# EAGLE board XmasRings (EAGLE 7.5.0), part 1 of 2
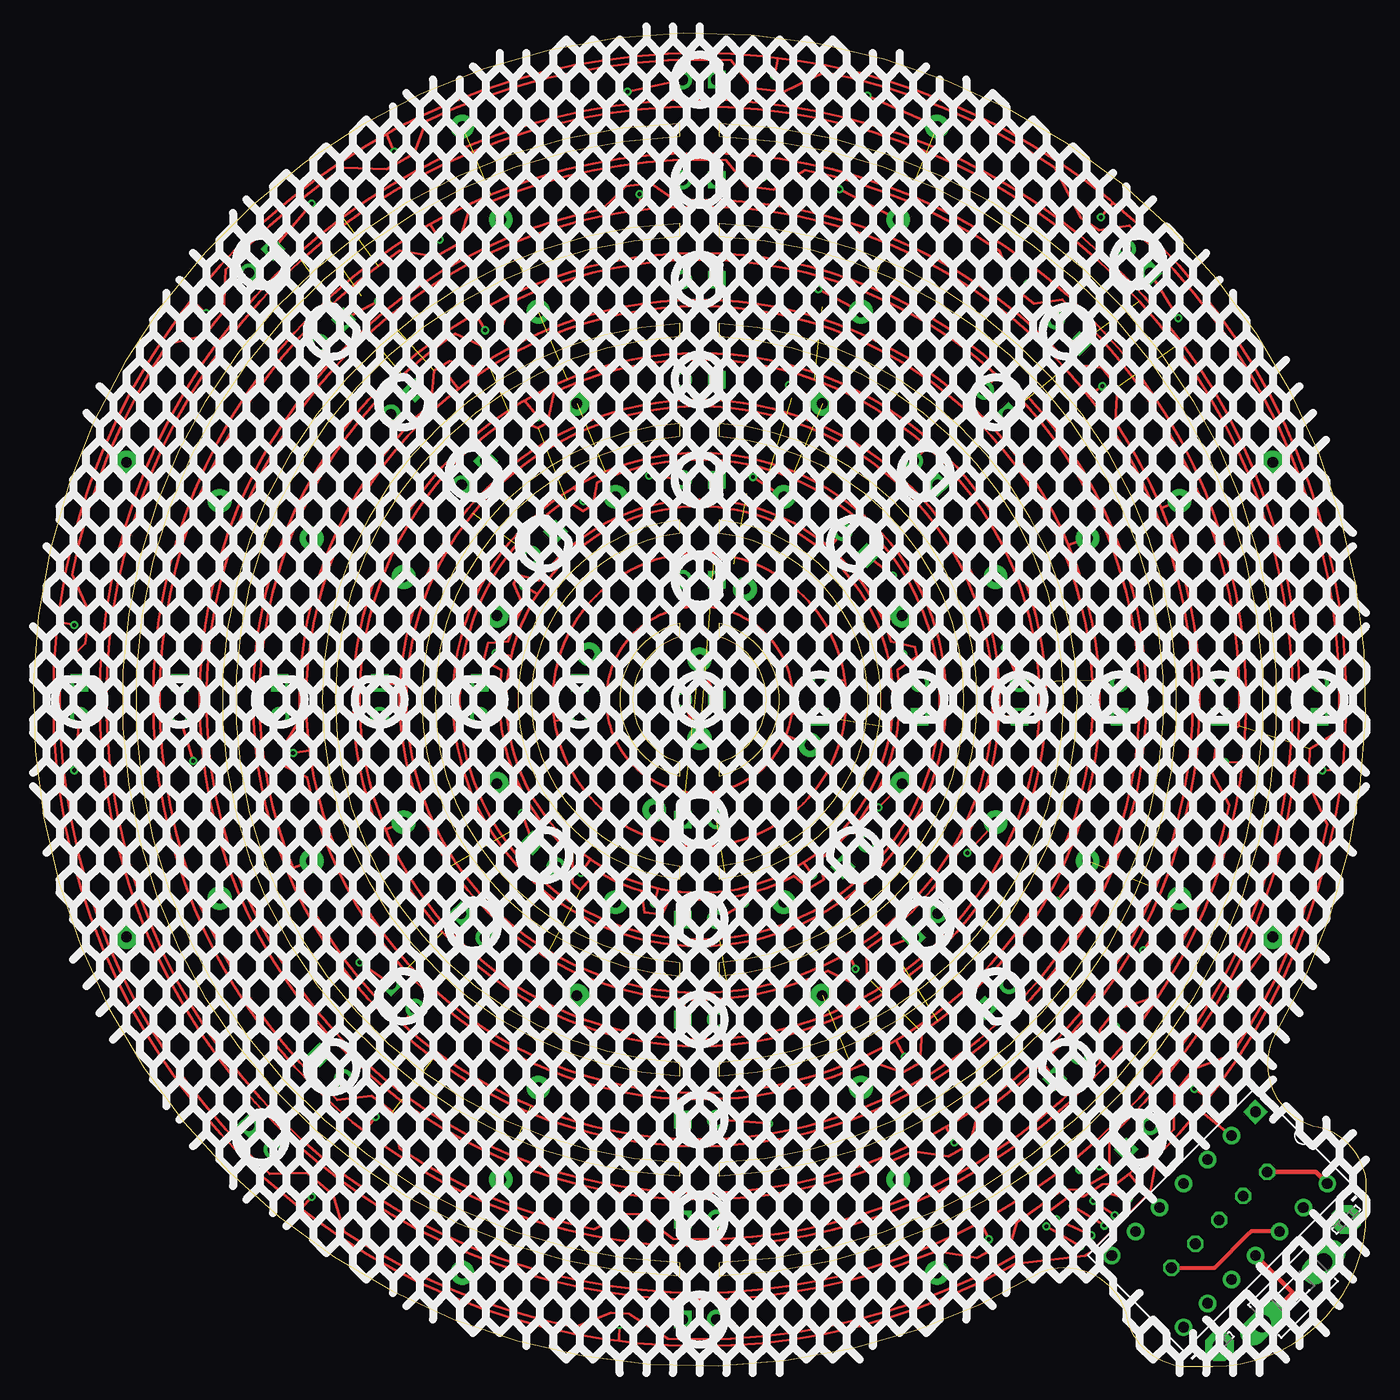
[diagram p1: board, top side]
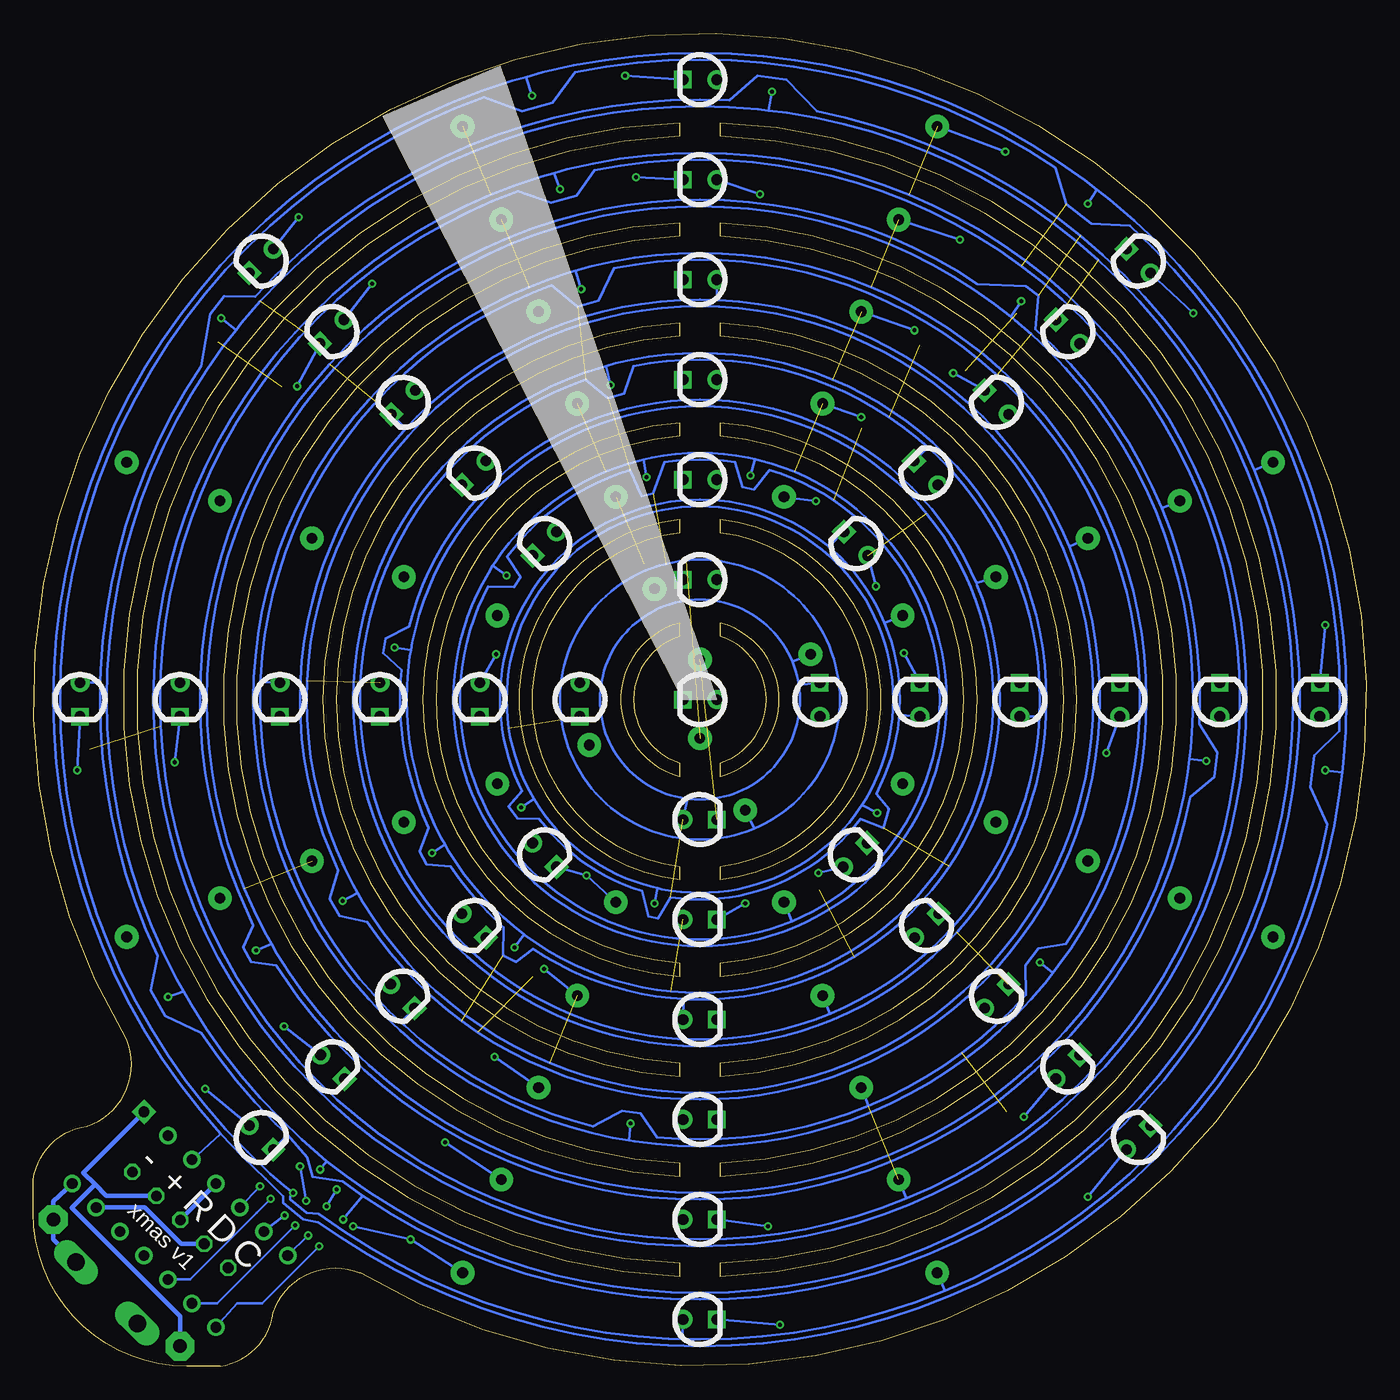
[diagram p2: board, bottom side, seen from below]

Size 99.98 x 99.98 mm. Coordinates in mm from the lower left corner, seen from the top.
Outline: 85.98,0 arc-74 81.98,4 arc94 75.48,7 arc-331 92.98,24.5 arc94 95.98,18 arc-74 99.98,14 99.98,11.5 arc-90 88.48,0 85.98,0
Outline: 48.48,36.5 arc-167 48.48,63.5 48.48,62.5 arc166 48.48,37.5 48.48,36.5
Outline: 48.48,29.25 arc-172 48.48,70.75 48.48,69.75 arc171 48.48,30.25 48.48,29.25
Outline: 48.48,44.25 arc-151 48.48,55.75 48.48,54.75 arc145 48.48,45.25 48.48,44.25
Outline: 48.48,21.75 arc-174 48.48,78.25 48.48,77.25 arc174 48.48,22.75 48.48,21.75
Outline: 48.48,15.25 arc-175 48.48,84.75 48.48,85.75 arc175 48.48,14.25 48.48,15.25
Outline: 48.48,6.75 arc-176 48.48,93.25 48.48,92.25 arc176 48.48,7.75 48.48,6.75
Outline: 51.48,63.5 arc-167 51.48,36.5 51.48,37.5 arc166 51.48,62.5 51.48,63.5
Outline: 51.48,70.75 arc-172 51.48,29.25 51.48,30.25 arc171 51.48,69.75 51.48,70.75
Outline: 51.48,55.75 arc-151 51.48,44.25 51.48,45.25 arc145 51.48,54.75 51.48,55.75
Outline: 51.48,78.25 arc-174 51.48,21.75 51.48,22.75 arc174 51.48,77.25 51.48,78.25
Outline: 51.48,84.75 arc-175 51.48,15.25 51.48,14.25 arc175 51.48,85.75 51.48,84.75
Outline: 51.48,93.25 arc-176 51.48,6.75 51.48,7.75 arc176 51.48,92.25 51.48,93.25
Copper layers (1*16): Top 0.035mm / dielectric 1.5mm / Bottom 0.035mm
Design rules "dirt_cheap_dirty_boards.v1": minimum track width 5mil, minimum drill 12mil, track to track 5mil, track to pad 5mil, pad to pad 5mil, via to via 5mil, smd to smd 0mil, copper to edge 10mil, drill to drill 10mil, minimum pad ring 10mil, minimum via ring 6mil, stop-mask expansion 2mil, vias tented up to drill 25mil, thermal gap 10mil
Net classes: 0 default: width 0.152 mm, drill 0.305 mm, clearance 0.152 mm

## Footprints (pad centres in the part's own frame; a part is rotated, then mirrored left to right if it is on the bottom)
LSP10 = drill 1.016 pad 2.159 octagon: MP 0,0
PAD08SS = drill 0.8 pad 1.778: MP 0,0
DIP14 = drill 0.8 square: 1 -7.62,-3.81 | drill 0.8: 2 -5.08,-3.81; 3 -2.54,-3.81; 4 0,-3.81; 5 2.54,-3.81; 6 5.08,-3.81; 7 7.62,-3.81; 8 7.62,3.81; 9 5.08,3.81; 10 2.54,3.81; 11 0,3.81; 12 -2.54,3.81; 13 -5.08,3.81; 14 -7.62,3.81
5MM-SQ = drill 0.8 pad 1.422: A -1.27,0 | drill 0.8 square: C 1.27,0
DTS-3 = drill 1.3 long: 1 -3.25,0; 2 3.25,0

## Placement (x,y rotation side)
+  LSP10  [LSP10]  88.98,1.5 45 top
-  LSP10  [LSP10]  98.48,11 45 top
H1A  PADH08SS  [PAD08SS]  32.18,93 0 top
H1B  PADH08SS  [PAD08SS]  35.08,86 0 top
H1C  PADH08SS  [PAD08SS]  37.88,79.1 0 top
H1D  PADH08SS  [PAD08SS]  40.78,72.2 0 top
H1E  PADH08SS  [PAD08SS]  43.68,65.2 0 top
H2A  PADH08SS  [PAD08SS]  6.98,32.2 0 top
H2B  PADH08SS  [PAD08SS]  13.98,35.1 0 top
H2C  PADH08SS  [PAD08SS]  20.88,37.9 0 top
H2D  PADH08SS  [PAD08SS]  27.78,40.8 0 top
H2E  PADH08SS  [PAD08SS]  34.78,43.7 0 top
H3A  PADH08SS  [PAD08SS]  92.98,67.8 0 top
H3B  PADH08SS  [PAD08SS]  85.98,64.9 0 top
H3C  PADH08SS  [PAD08SS]  79.08,62.1 0 top
H3D  PADH08SS  [PAD08SS]  72.18,59.2 0 top
H3E  PADH08SS  [PAD08SS]  65.18,56.3 0 top
H4A  PADH08SS  [PAD08SS]  67.78,7 0 top
H4B  PADH08SS  [PAD08SS]  64.88,14 0 top
H4C  PADH08SS  [PAD08SS]  62.08,20.9 0 top
H4D  PADH08SS  [PAD08SS]  59.18,27.8 0 top
H4E  PADH08SS  [PAD08SS]  56.28,34.8 0 top
H5A  PADH08SS  [PAD08SS]  67.78,93 0 top
H5B  PADH08SS  [PAD08SS]  64.88,86 0 top
H5C  PADH08SS  [PAD08SS]  62.08,79.1 0 top
H5D  PADH08SS  [PAD08SS]  59.18,72.2 0 top
H5E  PADH08SS  [PAD08SS]  56.28,65.2 0 top
H5F  PADH08SS  [PAD08SS]  53.38,58.3 0 top
H5G  PADH08SS  [PAD08SS]  49.98,53 0 top
H6A  PADH08SS  [PAD08SS]  32.18,7 90 top
H6B  PADH08SS  [PAD08SS]  35.08,14 90 top
H6C  PADH08SS  [PAD08SS]  37.88,20.9 90 top
H6D  PADH08SS  [PAD08SS]  40.78,27.8 90 top
H6E  PADH08SS  [PAD08SS]  43.68,34.8 90 top
H6F  PADH08SS  [PAD08SS]  46.58,41.7 90 top
H6G  PADH08SS  [PAD08SS]  49.98,47.1 0 top
H7A  PADH08SS  [PAD08SS]  6.98,67.8 0 top
H7B  PADH08SS  [PAD08SS]  13.98,64.9 0 top
H7C  PADH08SS  [PAD08SS]  20.88,62.1 0 top
H7D  PADH08SS  [PAD08SS]  27.78,59.2 0 top
H7E  PADH08SS  [PAD08SS]  34.78,56.3 0 top
H7F  PADH08SS  [PAD08SS]  41.68,53.4 0 top
H8A  PADH08SS  [PAD08SS]  92.98,32.2 0 top
H8B  PADH08SS  [PAD08SS]  85.98,35.1 0 top
H8C  PADH08SS  [PAD08SS]  79.08,37.9 0 top
H8D  PADH08SS  [PAD08SS]  72.18,40.8 0 top
H8E  PADH08SS  [PAD08SS]  65.18,43.7 0 top
H8F  PADH08SS  [PAD08SS]  58.28,46.6 0 top
IC2  IC_UC_PIC16F1823-DIL14  [DIP14]  88.98,11 225 top
LED1  LED5SQ  [5MM-SQ]  49.98,96.5 0 top
LED2  LED5SQ  [5MM-SQ]  82.88,82.9 315 top
LED3  LED5SQ  [5MM-SQ]  96.48,50 270 top
LED4  LED5SQ  [5MM-SQ]  82.88,17.15 225 top
LED5  LED5SQ  [5MM-SQ]  49.98,3.5 180 top
LED6  LED5SQ  [5MM-SQ]  17.08,17.15 135 top
LED7  LED5SQ  [5MM-SQ]  3.48,50 90 top
LED8  LED5SQ  [5MM-SQ]  17.08,82.9 45 top
LED9  LED5SQ  [5MM-SQ]  49.98,89 0 top
LED10  LED5SQ  [5MM-SQ]  77.58,77.6 315 top
LED11  LED5SQ  [5MM-SQ]  88.98,50 270 top
LED12  LED5SQ  [5MM-SQ]  77.53,22.45 225 top
LED13  LED5SQ  [5MM-SQ]  49.98,11 180 top
LED14  LED5SQ  [5MM-SQ]  22.38,22.45 135 top
LED15  LED5SQ  [5MM-SQ]  10.98,50 90 top
LED16  LED5SQ  [5MM-SQ]  22.38,77.6 45 top
LED17  LED5SQ  [5MM-SQ]  49.98,81.5 0 top
LED18  LED5SQ  [5MM-SQ]  72.23,72.3 315 top
LED19  LED5SQ  [5MM-SQ]  81.48,50 270 top
LED20  LED5SQ  [5MM-SQ]  72.28,27.75 225 top
LED21  LED5SQ  [5MM-SQ]  49.98,18.5 180 top
LED22  LED5SQ  [5MM-SQ]  27.73,27.75 135 top
LED23  LED5SQ  [5MM-SQ]  18.48,50 90 top
LED24  LED5SQ  [5MM-SQ]  27.73,72.3 45 top
LED25  LED5SQ  [5MM-SQ]  49.98,74 0 top
LED26  LED5SQ  [5MM-SQ]  66.93,67 315 top
LED27  LED5SQ  [5MM-SQ]  73.98,50 270 top
LED28  LED5SQ  [5MM-SQ]  66.93,33.05 225 top
LED29  LED5SQ  [5MM-SQ]  49.98,26 180 top
LED30  LED5SQ  [5MM-SQ]  32.98,33.05 135 top
LED31  LED5SQ  [5MM-SQ]  25.98,50 90 top
LED32  LED5SQ  [5MM-SQ]  33.03,67 45 top
LED33  LED5SQ  [5MM-SQ]  49.98,66.5 0 top
LED34  LED5SQ  [5MM-SQ]  61.63,61.7 315 top
LED35  LED5SQ  [5MM-SQ]  66.48,50 270 top
LED36  LED5SQ  [5MM-SQ]  61.63,38.35 225 top
LED37  LED5SQ  [5MM-SQ]  49.98,33.5 180 top
LED38  LED5SQ  [5MM-SQ]  38.33,38.35 135 top
LED39  LED5SQ  [5MM-SQ]  33.48,50 90 top
LED40  LED5SQ  [5MM-SQ]  38.28,61.7 45 top
LED41  LED5SQ  [5MM-SQ]  49.98,59 0 top
LED42  LED5SQ  [5MM-SQ]  58.98,50 270 top
LED43  LED5SQ  [5MM-SQ]  49.98,41 180 top
LED44  LED5SQ  [5MM-SQ]  40.98,50 90 top
LED45  LED5SQ  [5MM-SQ]  49.98,50 0 top
S1  DTS-3  [DTS-3]  94.48,5.5 45 top

## Tracks (layer width: path | path; a pad name or v marks a point on that pad's centre or on a via)
/RES  (via drill 0.8)
  Bottom 0.356: v88.95,10.97 IC2.4
CLK  (via drill 0.8)
  Top 0.203: 91.33,10.1 91.23,10
  Top 0.305: v85.36,7.38 88.61,7.38 91.23,10 | IC2.12 91.33,10.1
CP1  (via drill 0.3)  (4 unrouted)
  Top 0.203: 55.85,98.13 54.73,98.27 52.36,98.44 49.98,98.5 47.6,98.44 45.22,98.27 42.86,97.97 40.52,97.57 38.19,97.05 35.9,96.41 33.64,95.67 31.42,94.81 29.24,93.84 27.11,92.77 26.48,92.42 | 55.85,98.13 57.09,97.97 59.44,97.57 61.76,97.05 64.06,96.41 66.32,95.67 68.54,94.81 70.71,93.84 72.84,92.77 74.91,91.6 76.92,90.33 78.87,88.96 80.75,87.49 80.99,87.28 | 80.99,87.28 82.55,85.94 84.27,84.3 85.91,82.57 87.47,80.77 88.93,78.89 90.3,76.94 91.58,74.93 92.75,72.86 93.82,70.74 94.79,68.56 95.64,66.34 96.39,64.08 97.02,61.78 97.55,59.46 97.95,57.12 98.24,54.75 98.42,52.38 98.48,50 98.42,47.62 98.24,45.25 98.18,44.74 | 98.18,44.74 97.95,42.88 97.55,40.54 97.02,38.22 96.39,35.92 95.64,33.66 94.79,31.44 93.82,29.26 92.75,27.14 91.58,25.07 90.3,23.05 88.93,21.11 88.15,20.11 | 88.15,20.11 87.47,19.23 | 87.47,19.23 85.91,17.43 84.27,15.71 83.8,13.06 79.25,8.51 78.87,8.29 73.67,7.67 73.16,7.4 72.84,7.23 70.71,6.16 68.54,5.19 66.32,4.33 64.06,3.59 61.76,2.95 59.44,2.43 57.09,2.02 54.73,1.73 52.36,1.56 49.98,1.5 47.6,1.56 45.22,1.73 43.93,1.89 | 43.93,1.89 42.86,2.02 40.52,2.43 38.19,2.95 35.9,3.59 33.64,4.33 31.42,5.19 29.24,6.16 27.11,7.23 25.04,8.4 23.03,9.67 21.09,11.04 20.11,11.81 | 20.11,11.81 19.21,12.51 17.41,14.06 15.68,15.71 14.04,17.43 12.49,19.23 11.02,21.11 9.65,23.05 8.38,25.07 7.2,27.14 6.13,29.26 5.17,31.44 4.31,33.66 3.57,35.92 2.93,38.22 2.41,40.54 2,42.88 1.71,45.25 1.54,47.62 1.48,50 1.54,52.38 1.71,54.75 1.85,55.87 | 1.85,55.87 2,57.12 2.41,59.46 2.93,61.78 3.57,64.08 4.31,66.34 5.17,68.56 6.13,70.74 7.2,72.86 8.38,74.93 9.65,76.94 11.02,78.89 11.89,80
  Top 0.203: 11.89,80 12.49,80.77 14.04,82.57 15.68,84.3 17.41,85.94 19.21,87.49 21.09,88.96 23.03,90.33 25.04,91.6 26.48,92.42 | 55.05,90.67 54,90.8 51.99,90.95 49.98,91 47.97,90.95 45.96,90.8 43.96,90.56 41.98,90.21 40.02,89.77 38.08,89.23 36.17,88.6 34.29,87.88 32.45,87.06 30.65,86.16 29.76,85.66 | 55.05,90.67 55.99,90.56 57.98,90.21 59.94,89.77 61.88,89.23 63.79,88.6 65.67,87.88 67.51,87.06 69.3,86.16 71.06,85.17 72.76,84.09 74.4,82.93 75.31,82.22 | 75.31,82.22 75.99,81.69 77.51,80.38 78.97,78.99 80.36,77.53 81.67,76.01 82.91,74.42 84.07,72.78 85.14,71.08 86.14,69.33 87.04,67.53 87.86,65.69 88.58,63.81 89.21,61.9 89.75,59.96 90.19,58 90.53,56.02 90.78,54.02 90.93,52.01 90.98,50 90.93,47.99 90.78,45.98 90.7,45.32 | 90.7,45.32 90.53,43.98 90.19,42 89.75,40.04 89.21,38.1 88.58,36.19 87.86,34.31 87.04,32.47 86.14,30.67 85.14,28.92 84.07,27.22 82.91,25.58 82.29,24.78 | 82.29,24.78 81.67,23.99 80.36,22.47 78.97,21.01 77.51,19.62 75.99,18.31 74.4,17.07 72.76,15.91 71.06,14.83 69.3,13.84 67.51,12.94 65.67,12.12 63.79,11.4 61.88,10.77 59.94,10.23 57.98,9.79 55.99,9.44 54,9.2 51.99,9.05 49.98,9 47.97,9.05 45.96,9.2 44.71,9.35 | 44.71,9.35 43.96,9.44 41.98,9.79 40.02,10.23 38.08,10.77 36.17,11.4 34.29,12.12 32.45,12.94 30.65,13.84 28.9,14.83 27.2,15.91 25.55,17.07 24.87,17.6 | 24.87,17.6 23.97,18.31 22.44,19.62 20.99,21.01 19.6,22.47 18.28,23.99 17.05,25.58 15.89,27.22 14.81,28.92 13.82,30.67 12.91,32.47 12.1,34.31 11.37,36.19 10.74,38.1 10.21,40.04 9.77,42 9.42,43.98 9.17,45.98 9.03,47.99 8.98,50 9.03,52.01 9.17,54.02 9.42,56.02 9.77,58 10.21,59.96 10.74,61.9 11.37,63.81 12.1,65.69 12.91,67.53 13.82,69.33 14.81,71.08 15.89,72.78 17.05,74.42 18.28,76.01 19.6,77.53 20.99,78.99 22.44,80.38 23.97,81.69 25.55,82.93 27.2,84.09 28.9,85.17 29.76,85.66
  Top 0.203: 33.16,78.96 32.76,78.73 31.37,77.85 30.02,76.91 28.73,75.9 27.48,74.82 26.29,73.69 25.16,72.5 24.08,71.25 23.07,69.96 22.12,68.61 21.24,67.22 20.43,65.79 19.69,64.32 19.03,62.82 18.44,61.29 17.92,59.73 17.48,58.14 17.12,56.54 16.84,54.91 16.64,53.28 16.52,51.64 16.48,50 16.52,48.36 16.64,46.72 16.84,45.09 17.12,43.46 17.48,41.86 17.92,40.27 18.44,38.71 19.03,37.18 19.69,35.68 20.43,34.21 21.24,32.78 22.12,31.39 23.07,30.04 24.08,28.75 25.16,27.5 26.29,26.31 27.48,25.18 28.73,24.1 30.02,23.09 31.37,22.15 32.76,21.27 34.19,20.46 35.65,19.72 37.16,19.05 38.69,18.46 40.25,17.94 41.84,17.5 43.44,17.14 45.06,16.86 46.69,16.66 48.33,16.54 49.98,16.5 51.62,16.54 53.26,16.66 54.89,16.86 56.51,17.14 58.12,17.5 59.7,17.94 61.26,18.46 62.8,19.05 64.3,19.72 65.77,20.46 67.2,21.27 68.59,22.15 69.93,23.09 71.23,24.1 72.47,25.18 73.67,26.31 74.8,27.5 75.87,28.75 76.88,30.04 77.83,31.39 78.71,32.78 79.52,34.21 80.26,35.68 80.93,37.18 81.52,38.71 82.04,40.27 82.47,41.86 82.83,43.46 83.11,45.09 83.32,46.72 83.44,48.36 83.48,50 83.44,51.64 83.32,53.28 83.11,54.91 82.83,56.54 82.47,58.14 82.04,59.73 81.52,61.29 80.93,62.82 80.26,64.32 79.52,65.79 78.71,67.22 77.83,68.61 76.88,69.96 75.87,71.25 74.8,72.5 73.67,73.69 72.47,74.82 71.23,75.9 69.93,76.91 68.59,77.85 67.2,78.73 65.77,79.54 64.3,80.28 62.8,80.95 61.26,81.54 59.7,82.06 58.12,82.5 56.51,82.86 54.89,83.14 53.26,83.34 51.62,83.46 49.98,83.5 48.33,83.46 46.69,83.34 45.06,83.14 43.44,82.86 41.84,82.5 40.25,82.06 38.69,81.54 37.16,80.95 35.65,80.28 34.19,79.54 33.16,78.96
  Top 0.203: 36.84,72.43 36.61,72.3 35.53,71.62 34.49,70.88 33.48,70.1 32.52,69.27 31.59,68.39 30.71,67.46 29.88,66.49 29.09,65.49 28.36,64.44 27.68,63.37 27.05,62.26 26.47,61.12 25.96,59.95 25.5,58.76 25.1,57.55 24.76,56.32 24.48,55.07 24.26,53.81 24.1,52.55 24.01,51.28 23.98,50 24.01,48.72 24.1,47.45 24.26,46.19 24.48,44.93 24.76,43.68 25.1,42.45 25.5,41.24 25.96,40.05 26.47,38.88 27.05,37.74 27.68,36.63 28.36,35.55 29.09,34.51 29.88,33.51 30.71,32.54 31.59,31.61 32.52,30.73 33.48,29.9 34.49,29.12 35.53,28.38 36.61,27.7 37.72,27.07 38.86,26.5 40.03,25.98 41.22,25.52 42.43,25.12 43.66,24.78 44.91,24.5 46.16,24.28 47.43,24.12 48.7,24.03 49.98,24 51.25,24.03 52.53,24.12 53.79,24.28 55.05,24.5 56.29,24.78 57.52,25.12 58.74,25.52 59.93,25.98 61.09,26.5 62.23,27.07 63.34,27.7 64.42,28.38 65.47,29.12 66.47,29.9 67.44,30.73 68.36,31.61 69.24,32.54 70.08,33.51 70.86,34.51 71.6,35.55 72.28,36.63 72.91,37.74 73.48,38.88 74,40.05 74.46,41.24 74.86,42.45 75.2,43.68 75.48,44.93 75.7,46.19 75.85,47.45 75.95,48.72 75.98,50 75.95,51.28 75.85,52.55 75.7,53.81 75.48,55.07 75.2,56.32 74.86,57.55 74.46,58.76 74,59.95 73.48,61.12 72.91,62.26 72.28,63.37 71.6,64.44 70.86,65.49 70.08,66.49 69.24,67.46 68.36,68.39 67.44,69.27 66.47,70.1 65.47,70.88 64.42,71.62 63.34,72.3 62.23,72.93 61.09,73.5 59.93,74.02 58.74,74.48 57.52,74.88 56.29,75.22 55.05,75.5 53.79,75.72 52.53,75.88 51.25,75.97 49.98,76 48.7,75.97 47.43,75.88 46.16,75.72 44.91,75.5 43.66,75.22 42.43,74.88 41.22,74.48 40.03,74.02 38.86,73.5 37.72,72.93 36.84,72.43
  Top 0.203: 40.58,65.93 40.47,65.87 39.7,65.38 38.96,64.86 38.24,64.3 37.55,63.71 36.9,63.08 36.27,62.42 35.68,61.74 35.12,61.02 34.6,60.28 34.11,59.51 33.66,58.72 33.25,57.91 32.89,57.08 32.56,56.23 32.27,55.37 32.03,54.49 31.83,53.61 31.68,52.72 31.57,51.81 31.5,50.91 31.48,50 31.5,49.09 31.57,48.19 31.68,47.28 31.83,46.39 32.03,45.51 32.27,44.63 32.56,43.77 32.89,42.92 33.25,42.09 33.66,41.28 34.11,40.49 34.6,39.72 35.12,38.98 35.68,38.26 36.27,37.58 36.9,36.92 37.55,36.29 38.24,35.7 38.96,35.14 39.7,34.62 40.47,34.13 41.26,33.68 42.07,33.28 42.9,32.91 43.75,32.58 44.61,32.3 45.48,32.05 46.37,31.86 47.26,31.7 48.16,31.59 49.07,31.52 49.98,31.5 50.89,31.52 51.79,31.59 52.69,31.7 53.59,31.86 54.47,32.05 55.35,32.3 56.21,32.58 57.06,32.91 57.89,33.28 58.7,33.68 59.49,34.13 60.26,34.62 61,35.14 61.71,35.7 62.4,36.29 63.06,36.92 63.69,37.58 64.28,38.26 64.84,38.98 65.36,39.72 65.85,40.49 66.29,41.28 66.7,42.09 67.07,42.92 67.4,43.77 67.68,44.63 67.92,45.51 68.12,46.39 68.28,47.28 68.39,48.19 68.46,49.09 68.48,50 68.46,50.91 68.39,51.81 68.28,52.72 68.12,53.61 67.92,54.49 67.68,55.37 67.4,56.23 67.07,57.08 66.7,57.91 66.29,58.72 65.85,59.51 65.36,60.28 64.84,61.02 64.28,61.74 63.69,62.42 63.06,63.08 62.4,63.71 61.71,64.3 61,64.86 60.26,65.38 59.49,65.87 58.7,66.32 57.89,66.72 57.06,67.09 56.21,67.42 55.35,67.7 54.47,67.95 53.59,68.14 52.69,68.3 51.79,68.41 50.89,68.48 49.98,68.5 49.07,68.48 48.16,68.41 47.26,68.3 46.37,68.14 45.48,67.95 44.61,67.7 43.75,67.42 42.9,67.09 42.07,66.72 41.26,66.32 40.58,65.93
  Top 0.203: v3.08,55.6 1.85,55.87 | v12.98,79 11.89,80 | v30.48,84.5 29.76,85.66 | v33.88,77.7 33.16,78.96 | v37.88,71.2 36.84,72.43 | v41.28,64.9 40.58,65.93 | v54.78,89.2 55.05,90.67 | v55.58,96.8 55.85,98.13 | v87.08,20.8 88.15,20.11 | v81.18,25.5 82.29,24.78 | v44.88,10.5 44.71,9.35 | v43.98,3.1 43.93,1.89 | v25.68,18.7 24.87,17.6 | v20.88,12.7 20.11,11.81 | v80.08,86.2 80.99,87.28 | v74.58,81.2 75.31,82.22 | v89.38,45.3 90.7,45.32 | v96.68,44.7 98.18,44.74 | v27.08,91.1 26.48,92.42 | IC2.2 87.47,19.23
  Bottom 0.203: LED7.C v3.08,55.6 | LED8.A v12.98,79 | H1E.MP v41.28,64.9 | H1D.MP v37.88,71.2 | H1C.MP v33.88,77.7 | H1B.MP v30.48,84.5 | H1A.MP v27.08,91.1 | LED1.C v55.58,96.8 | LED9.C v54.78,89.2 | LED12.A v81.18,25.5 | LED4.A v87.08,20.8 | LED13.C v44.88,10.5 | LED5.C v43.98,3.1 | LED6.A v20.88,12.7 | LED14.A v25.68,18.7 | LED10.A v74.58,81.2 | LED2.A v80.08,86.2 | LED11.C v89.38,45.3 | LED3.C v96.68,44.7
CP2  (via drill 0.3)  (4 unrouted)
  Top 0.203: 82.21,14.43 83.92,16.06 85.54,17.77 85.58,20.45 87.03,22.31 89.89,23.33 91.15,25.32 92.31,27.37 93.37,29.48 94.32,31.63 95.17,33.83 95.91,36.07 96.54,38.34 97.06,40.64 95.66,43.66 95.75,46.3 97.92,47.65 97.98,50 97.92,52.35 97.75,54.7 97.46,57.04 97.06,59.36 96.54,61.66 95.91,63.93 95.17,66.17 94.32,68.37 93.37,70.52 92.31,72.63 91.15,74.68 89.89,76.67 88.53,78.59 87.08,80.45 85.54,82.23 83.92,83.94 82.21,85.57 79.93,85.2 78.57,86.15 76.64,89.91 74.65,91.17 72.6,92.33 70.5,93.39 68.35,94.35 66.15,95.19 63.91,95.93 61.64,96.56 59.34,97.08 56.32,95.58 53.98,95.87 52.33,97.94 49.98,98 47.62,97.94 45.27,97.77 42.93,97.48 40.61,97.08 38.31,96.56 36.04,95.93 33.81,95.19 31.61,94.35 29.45,93.39 28.55,90.93 26.5,89.77 23.31,89.91 21.38,88.55 19.53,87.11 17.74,85.57 16.04,83.94 14.41,82.23 14.27,79.15 12.82,77.29 10.07,76.67 8.81,74.68 7.65,72.63 6.59,70.52 5.63,68.37 4.78,66.17 4.04,63.93 3.42,61.66 2.9,59.36 4.2,56.54 3.91,54.2 2.04,52.35 1.98,50 2.04,47.65 2.21,45.3 2.5,42.96 2.9,40.64 3.42,38.34 4.04,36.07 4.78,33.83 5.63,31.63 | 82.21,14.43 81.23,13.68 80.18,13.64 78.78,12.75 77.73,12.75 75.22,10.9 74.79,9.29 74.65,8.83 72.6,7.67 70.5,6.61 68.35,5.65 66.15,4.81 63.91,4.07 61.64,3.44 59.34,2.92 57.02,2.52 54.68,2.23 52.33,2.06 49.98,2 47.62,2.06 44.67,3.93 43.33,4.02 40.61,2.92 38.31,3.44 36.04,4.07 33.81,4.81 31.61,5.65 29.45,6.61 27.35,7.67 25.3,8.83 23.31,10.09 22.48,12.85 20.53,14.49 17.74,14.43 16.04,16.06 14.41,17.77 12.87,19.55 11.42,21.41 10.07,23.33 8.81,25.32 7.65,27.37 6.59,29.48 5.63,31.63
  Top 0.203: 51.29,9.53 51.49,9.54 51.96,9.55 53.95,9.7 55.92,9.94 57.88,10.28 59.82,10.71 61.73,11.24 63.62,11.87 65.48,12.58 67.29,13.39 69.07,14.28 70.8,15.26 72.48,16.32 74.1,17.47 75.67,18.69 77.18,19.99 78.62,21.36 79.99,22.8 79.98,25.21 81.21,26.77 83.65,27.5 84.72,29.18 85.7,30.91 86.59,32.68 87.39,34.5 88.11,36.36 88.73,38.24 89.26,40.16 89.7,42.1 88.44,44.46 88.68,46.43 90.43,48.01 90.48,50 90.43,51.99 90.28,53.97 90.04,55.94 89.7,57.9 89.26,59.84 88.73,61.76 88.11,63.64 87.39,65.5 86.59,67.32 85.7,69.09 84.72,70.82 83.65,72.5 82.51,74.13 81.28,75.69 79.99,77.2 78.62,78.64 77.18,80.01 75.07,79.71 73.5,80.93 72.48,83.67 70.8,84.74 69.07,85.72 67.29,86.61 65.48,87.42 63.62,88.13 61.73,88.76 59.82,89.29 57.88,89.72 55.52,88.26 53.55,88.5 51.96,90.45 49.98,90.5 47.99,90.45 46.01,90.31 44.03,90.06 42.08,89.72 40.14,89.29 38.22,88.76 36.33,88.13 34.48,87.42 32.66,86.61 31.89,84.22 30.16,83.24 27.48,83.67 25.85,82.53 24.28,81.31 22.78,80.01 21.34,78.64 20.4,77.66 | 51.29,9.53 49.98,9.5 47.99,9.55 45.51,11.39 44.33,11.44 42.08,10.28 40.14,10.71 38.22,11.24 36.33,11.87 34.48,12.58 32.66,13.39 30.89,14.28 29.16,15.26 27.48,16.32 26.95,19.07 25.38,20.29 22.78,19.99 21.34,21.36 20.4,22.34 | 20.4,22.34 19.97,22.8 18.67,24.31 17.45,25.87 16.3,27.5 15.24,29.18 14.26,30.91 13.37,32.68 12.56,34.5 | 12.56,34.5 11.84,36.36 11.22,38.24 10.69,40.16 10.26,42.1 9.92,44.06 9.67,46.03 9.53,48.01 9.48,50 9.51,51.31 | 9.51,51.31 9.53,51.99 9.67,53.97 9.92,55.94 10.26,57.9 10.69,59.84 11.22,61.76 11.84,63.64 12.56,65.5 13.37,67.32 14.26,69.09 15.24,70.82 16.3,72.5 17.45,74.13 18.67,75.69 19.97,77.2 20.4,77.66
  Top 0.203: 51.29,82.97 49.98,83 48.36,82.96 46.74,82.84 45.14,82.64 43.54,82.37 41.96,82.01 40.4,81.58 38.86,81.07 37.35,80.49 35.87,79.83 34.92,77.4 33.51,76.61 31.64,77.44 30.32,76.51 29.04,75.51 27.82,74.45 26.64,73.33 25.75,72.4 | 51.29,82.97 51.6,82.96 53.21,82.84 54.82,82.64 56.42,82.37 58,82.01 59.56,81.58 61.09,81.07 62.61,80.49 64.09,79.83 65.53,79.1 66.94,78.31 68.31,77.44 69.64,76.51 70.91,75.51 72.14,74.45 72.33,74.27 | 72.33,74.27 73.31,73.33 74.43,72.16 75.49,70.94 76.48,69.66 77.42,68.33 78.28,66.97 79.08,65.56 79.81,64.11 80.47,62.63 81.05,61.12 81.56,59.58 81.99,58.02 82.34,56.44 82.62,54.84 82.82,53.23 82.94,51.62 82.98,50 82.95,48.69 | 82.95,48.69 82.94,48.38 82.82,46.77 82.62,45.16 82.34,43.56 81.99,41.98 81.56,40.42 81.05,38.88 80.47,37.37 79.81,35.89 79.08,34.44 78.28,33.03 77.42,31.67 76.48,30.34 75.49,29.07 74.43,27.84 74.25,27.65 | 74.25,27.65 73.31,26.66 72.14,25.55 70.91,24.49 69.64,23.49 68.31,22.56 66.94,21.7 65.53,20.9 64.09,20.17 62.61,19.51 61.09,18.93 59.56,18.42 58,17.99 56.42,17.63 54.82,17.36 53.21,17.16 51.6,17.04 49.98,17 48.66,17.03 | 48.66,17.03 48.36,17.04 46.74,17.16 45.14,17.36 43.54,17.63 41.96,17.99 40.4,18.42 38.86,18.93 37.35,19.51 35.87,20.17 34.42,20.9 33.01,21.7 31.64,22.56 30.32,23.49 29.04,24.49 27.82,25.55 27.68,25.68 | 27.68,25.68 26.64,26.66 25.53,27.84 24.47,29.07 23.47,30.34 22.54,31.67 21.67,33.03 20.87,34.44 20.15,35.89 19.49,37.37 | 19.49,37.37 18.91,38.88 18.4,40.42 17.97,41.98 17.61,43.56 17.33,45.16 17.14,46.77 17.02,48.38 16.98,50 17.01,51.31 | 17.01,51.31 17.02,51.62 17.14,53.23 17.33,54.84 17.61,56.44 17.97,58.02 18.4,59.58 18.91,61.12 19.49,62.63 20.15,64.11 20.87,65.56 21.67,66.97 22.54,68.33 23.47,69.66 24.47,70.94 25.53,72.16 25.75,72.4
  Top 0.203: 51.23,75.47 49.98,75.5 48.73,75.47 47.48,75.38 46.24,75.22 45,75.01 43.78,74.74 42.58,74.4 41.39,74.01 40.22,73.56 39.07,73.05 38.56,70.79 37.87,70.37 35.81,71.2 34.79,70.48 33.8,69.71 32.85,68.89 31.95,68.03 31.08,67.12 30.27,66.18 29.5,65.19 28.78,64.17 28.11,63.11 27.49,62.02 26.93,60.9 26.42,59.76 25.97,58.59 25.58,57.4 25.24,56.2 24.97,54.98 24.75,53.74 24.6,52.5 24.51,51.25 24.48,50 24.51,48.75 24.6,47.5 24.75,46.26 24.97,45.02 25.24,43.8 25.58,42.6 25.97,41.41 26.42,40.24 | 51.23,75.47 52.48,75.38 53.72,75.22 54.95,75.01 56.17,74.74 57.38,74.4 58.57,74.01 59.74,73.56 60.88,73.05 62,72.49 63.09,71.87 64.14,71.2 65.17,70.48 66.15,69.71 67.1,68.89 | 67.1,68.89 68.01,68.03 68.87,67.12 69.69,66.18 70.46,65.19 71.18,64.17 71.85,63.11 72.47,62.02 73.03,60.9 73.54,59.76 73.99,58.59 74.38,57.4 74.71,56.2 74.99,54.98 75.2,53.74 75.35,52.5 75.45,51.25 75.48,50 75.45,48.75 75.35,47.5 75.2,46.26 74.99,45.02 74.71,43.8 74.38,42.6 73.99,41.41 73.54,40.24 73.03,39.1 72.47,37.98 71.85,36.89 71.18,35.83 70.46,34.81 69.69,33.82 68.87,32.88 68.01,31.97 67.1,31.11 66.15,30.29 65.17,29.52 64.14,28.8 63.09,28.13 62,27.51 60.88,26.95 59.74,26.44 58.57,25.99 57.38,25.6 56.17,25.26 54.95,24.99 53.72,24.78 52.48,24.62 51.23,24.53 49.98,24.5 48.73,24.53 47.48,24.62 46.24,24.78 45,24.99 43.78,25.26 42.58,25.6 41.39,25.99 40.22,26.44 39.07,26.95 37.96,27.51 36.87,28.13 35.81,28.8 34.79,29.52 33.8,30.29 32.85,31.11 31.95,31.97 31.08,32.88 30.27,33.82 29.5,34.81 28.78,35.83 28.11,36.89 27.49,37.98 26.93,39.1 26.42,40.24
  Top 0.203: 33.35,43.11 33.71,42.3 34.1,41.52 34.54,40.75 35.01,40 35.52,39.28 36.06,38.58 36.64,37.91 37.25,37.27 37.89,36.66 38.56,36.09 39.25,35.54 39.98,35.03 40.72,34.56 41.49,34.12 42.28,33.73 43.09,33.37 43.91,33.05 44.75,32.77 45.6,32.54 46.47,32.35 47.34,32.2 48.21,32.09 49.09,32.02 49.98,32 50.86,32.02 51.74,32.09 52.62,32.2 53.49,32.35 54.35,32.54 55.2,32.77 56.04,33.05 56.87,33.37 57.67,33.73 58.46,34.12 59.23,34.56 59.98,35.03 60.7,35.54 61.4,36.09 62.07,36.66 62.71,37.27 63.31,37.91 63.89,38.58 64.44,39.28 64.94,40 65.42,40.75 65.85,41.52 66.25,42.3 66.61,43.11 66.93,43.94 67.2,44.77 67.44,45.63 67.63,46.49 67.78,47.36 67.89,48.24 67.96,49.12 67.98,50 67.96,50.88 67.89,51.76 67.78,52.64 67.63,53.51 67.44,54.37 67.2,55.23 66.93,56.06 66.61,56.89 66.25,57.7 65.85,58.48 65.42,59.25 64.94,60 64.44,60.72 63.89,61.42 63.31,62.09 62.71,62.73 62.07,63.34 61.4,63.91 60.7,64.46 59.98,64.97 59.23,65.44 58.46,65.88 57.67,66.27 56.87,66.63 56.04,66.95 55.2,67.22 54.35,67.46 53.49,67.65 52.62,67.81 51.74,67.91 50.86,67.98 49.98,68 49.09,67.98 48.21,67.91 47.34,67.81 46.47,67.65 45.6,67.46 44.75,67.22 43.91,66.95 43.09,66.63 42.28,66.27 41.99,64.58 41.22,64.14 39.98,64.97 39.25,64.46 38.56,63.91 37.89,63.34 37.25,62.73 36.64,62.09 36.06,61.42 35.52,60.72 35.01,60 34.54,59.25 34.1,58.48 33.71,57.7 33.35,56.89 33.03,56.06 32.75,55.23 32.52,54.37 32.32,53.51 32.17,52.64 32.06,51.76 32,50.88 31.98,50 32,49.12 32.06,48.24 32.17,47.36 32.32,46.49 32.52,45.63 32.75,44.77 33.03,43.94 33.35,43.11 | LED23.C 17.01,51.31
  Top 0.203: LED15.C 9.51,51.31 | LED24.A 25.75,72.4 | LED16.A 20.4,77.66 | LED19.C 82.95,48.69 | LED21.C 48.66,17.03 | LED14.C 20.4,22.34 | LED22.A 27.68,25.68 | H2D.MP 26.42,40.24 | H2C.MP 19.49,37.37 | H2B.MP 12.56,34.5 | H2A.MP 5.63,31.63 | H2E.MP 33.35,43.11 | LED17.C 51.29,82.97 | LED25.C 51.23,75.47 | LED18.A 72.33,74.27 | LED26.A 67.1,68.89 | LED13.A 51.29,9.53 | LED20.A 74.25,27.65 | 82.21,14.43 v82.98,13.5
  Bottom 0.203: IC2.5 v82.98,13.5
CP3  (via drill 0.3)  (4 unrouted)
  Top 0.203: 91.55,67.22 90.66,69.24 89.66,71.21 88.58,73.14 87.39,75 86.12,76.81 84.76,78.55 83.32,80.22 81.8,81.82 80.2,83.34 78.53,84.78 76.78,86.14 74.98,87.42 73.11,88.6 71.19,89.69 69.22,90.68 67.2,91.58 65.14,92.37 63.04,93.06 60.91,93.65 58.76,94.14 56.58,94.51 54.39,94.78 52.19,94.95 49.98,95 47.77,94.95 45.57,94.78 43.37,94.51 41.2,94.14 39.04,93.65 36.91,93.06 34.82,92.37 32.76,91.58 30.74,90.68 28.76,89.69 26.84,88.6 24.98,87.42 23.17,86.14 21.43,84.78 19.76,83.34 18.16,81.82 16.63,80.22 15.19,78.55 13.83,76.81 12.56,75 11.38,73.14 10.29,71.21 9.3,69.24 8.4,67.22 7.61,65.16 6.92,63.06 6.33,60.93 5.84,58.78 5.46,56.6 5.19,54.41 5.03,52.21 4.98,50 5.03,47.79 5.19,45.59 5.46,43.4 5.84,41.22 6.33,39.07 6.92,36.94 7.61,34.84 8.4,32.78 9.3,30.76 10.29,28.79 11.38,26.86 12.56,25 13.83,23.19 15.19,21.45 16.63,19.78 18.16,18.18 19.76,16.66 21.43,15.21 23.17,13.86 24.98,12.58 26.84,11.4 28.76,10.31 30.74,9.32 32.76,8.43 34.82,7.63 36.91,6.94 39.04,6.35 41.2,5.87 43.37,5.49 45.57,5.22 47.77,5.05 49.98,5 52.19,5.05 54.39,5.22 56.58,5.49 58.76,5.87 60.91,6.35 63.04,6.94 65.14,7.63 67.2,8.43 67.82,8.62 70.79,8.11 73.41,9.5 73.78,10.78 76.08,12.46 v77.23,13.25 78.53,13.21 80.73,14.5 80.7,17.16 81.8,18.18 83.32,19.78 84.76,21.45 86.12,23.19 87.39,25 88.58,26.86 89.66,28.79 90.66,30.76 91.55,32.78 92.35,34.84 93.04,36.94 93.63,39.07 94.11,41.22 94.49,43.4 94.76,45.59 94.92,47.79 94.98,50 94.92,52.21 94.76,54.41 94.49,56.6 94.11,58.78 93.63,60.93 93.04,63.06 92.35,65.16 91.55,67.22 | 84.62,64.35 83.88,66.03 83.05,67.68 82.14,69.28 81.16,70.83 81.3,73.44 80.17,74.89 77.76,75.18 76.49,76.52 75.16,77.79 73.77,78.99 72.32,80.12 70.81,81.18 69.26,82.17 67.65,83.07 66.01,83.9 64.33,84.64 62.61,85.31 60.86,85.89 59.09,86.38 57.29,86.78 55.48,87.09 53.65,87.32 51.82,87.45 49.98,87.5 48.14,87.45 46.3,88.72 44.48,88.49 42.66,86.78 40.87,86.38 39.09,85.89 37.34,85.31 35.63,84.64 33.94,83.9 32.3,83.07 30.7,82.17 29.14,81.18 27.64,80.12 26.19,78.99 24.79,77.79 23.46,76.52 22.19,75.18 20.99,73.79 19.86,72.34 18.8,70.83 17.81,69.28 16.91,67.68 16.08,66.03 15.33,64.35 14.67,62.63 14.09,60.89 13.6,59.11 13.2,57.32 12.88,55.5 12.66,53.68 12.52,51.84 12.48,50 12.52,48.16 12.66,46.32 12.88,44.5 13.2,42.68 13.6,40.89 14.09,39.11 14.67,37.37 15.33,35.65 16.08,33.97 16.91,32.32 17.81,30.72 18.8,29.17 19.86,27.66 20.99,26.21 22.19,24.82 23.46,23.48 24.79,22.21 26.19,21.01 27.64,19.88 29.14,18.82 30.7,17.84 32.3,16.93 33.94,16.1 35.63,15.36 37.34,14.69 39.09,14.12 40.87,13.62 42.66,13.22 44.48,12.91 46.3,12.68 48.14,12.54 49.98,12.5 51.82,12.54 53.65,12.68 55.48,12.91 57.29,13.22 59.09,13.62 60.86,14.12 62.61,14.69 64.33,15.36 66.01,16.1 68.65,15.73 70.26,16.64 70.81,18.82 72.32,19.88 73.77,21.01 75.16,22.21 75.73,22.76
  Top 0.203: 84.62,64.35 85.29,62.63 85.86,60.89 86.35,59.11 86.76,57.32 87.07,55.5 87.3,53.68 87.43,51.84 87.45,51.29 | 87.45,51.29 87.48,50 87.43,48.16 87.3,46.32 87.07,44.5 86.76,42.68 86.35,40.89 85.86,39.11 85.29,37.37 84.62,35.65 83.88,33.97 83.05,32.32 82.14,30.72 81.16,29.17 80.1,27.66 78.97,26.21 77.76,24.82 76.49,23.48 75.73,22.76 | 77.64,61.61 77.1,62.83 76.44,64.14 75.71,65.42 74.92,66.67 74.07,67.87 73.17,69.03 72.21,70.15 71.19,71.21 70.12,72.23 69.01,73.19 67.85,74.1 66.64,74.94 65.4,75.73 64.12,76.46 62.8,77.12 61.46,77.72 60.08,78.25 58.69,78.71 57.27,79.1 55.83,79.42 54.38,79.67 52.92,79.86 51.45,79.96 49.98,80 48.51,79.96 47.04,79.86 45.58,79.67 44.12,79.42 42.69,79.1 41.27,78.71 39.87,78.25 38.5,77.72 37.15,77.12 35.84,76.46 34.55,75.73 33.31,74.94 31.21,75.4 30.05,74.69 29.83,72.23 28.76,71.21 27.75,70.15 26.79,69.03 25.88,67.87 25.03,66.67 24.25,65.42 23.52,64.14 22.86,62.83 22.26,61.48 21.73,60.11 21.27,58.71 20.88,57.29 20.55,55.85 20.3,54.4 20.12,52.94 20.01,51.47 19.98,50 20.01,48.53 18.72,46.46 18.9,45 20.55,44.15 20.88,42.71 21.27,41.29 21.73,39.89 22.26,38.52 22.86,37.17 23.52,35.86 24.25,34.58 25.03,33.33 25.88,32.13 26.79,30.97 27.75,29.85 28.76,28.79 29.83,27.77 30.95,26.81 32.11,25.9 33.31,25.06 34.55,24.27 35.84,23.54 37.15,22.88 38.5,22.28 39.87,21.75 41.27,21.29 42.69,20.9 44.12,20.58 45.58,20.32 47.04,20.14 48.51,20.04 49.98,20 51.45,20.04 52.92,20.14 54.38,20.32 55.83,20.58 57.27,20.9 58.69,21.29 60.08,21.75 61.46,22.28 62.8,22.88 65.22,22.04 66.5,22.77 66.64,25.06 67.85,25.9 69.01,26.81 70.12,27.77 71.19,28.79 72.21,29.85 73.17,30.97 74.07,32.13 74.92,33.33 75.71,34.58 76.44,35.86 77.1,37.17 77.69,38.52 78.22,39.89 78.69,41.29 79.08,42.71 79.4,44.15 79.65,45.6 79.83,47.06 79.94,48.53 79.98,50 79.94,51.47 79.83,52.94 79.65,54.4 79.4,55.85 79.08,57.29 78.69,58.71 78.22,60.11 77.69,61.48 77.64,61.61
  Top 0.203: 66.65,65.11 65.89,65.91 65.09,66.67 64.25,67.39 63.38,68.07 62.48,68.71 61.54,69.3 60.58,69.84 59.6,70.34 58.59,70.79 57.56,71.19 56.51,71.53 55.44,71.83 54.37,72.07 53.28,72.26 52.18,72.39 51.08,72.47 49.98,72.5 48.87,72.47 48.71,72.46 | 66.65,65.11 67.37,64.27 68.05,63.4 68.69,62.5 69.28,61.57 69.82,60.61 70.32,59.62 70.76,58.61 | 70.76,58.61 71.16,57.58 71.51,56.53 71.8,55.47 72.05,54.39 72.23,53.3 72.37,52.2 72.45,51.1 72.48,50 72.45,48.9 72.44,48.73 | 72.44,48.73 72.37,47.8 72.23,46.7 72.05,45.61 71.8,44.53 71.51,43.47 71.16,42.42 70.76,41.39 70.32,40.38 69.82,39.39 69.28,38.43 68.69,37.5 68.05,36.6 67.37,35.73 66.74,34.99 | 66.74,34.99 66.65,34.89 65.89,34.09 65.09,33.33 64.25,32.61 63.38,31.93 62.48,31.29 62.54,29.2 61.58,28.66 59.6,29.66 58.59,29.21 57.56,28.82 56.51,28.47 55.44,28.17 54.37,27.93 53.28,27.74 52.18,27.61 51.08,27.53 49.98,27.5 48.87,27.53 | 48.87,27.53 47.77,27.61 46.68,27.74 45.59,27.93 44.51,28.17 43.45,28.47 42.4,28.82 41.37,29.21 40.36,29.66 39.37,30.16 38.41,30.7 37.48,31.29 36.57,31.93 35.7,32.61 35.02,33.2 | 35.02,33.2 34.87,33.33 34.07,34.09 33.31,34.89 32.58,35.73 31.91,36.6 31.27,37.5 30.68,38.43 30.13,39.39 29.64,40.38 29.19,41.39 28.79,42.42 28.45,43.47 28.15,44.53 27.91,45.61 27.72,46.7 27.59,47.8 27.5,48.9 27.48,50 27.5,51.1 | 27.5,51.1 27.59,52.2 27.72,53.3 27.91,54.39 28.15,55.47 28.45,56.53 28.79,57.58 29.19,58.61 29.64,59.62 30.13,60.61 30.68,61.57 31.27,62.5 31.91,63.4 32.58,64.27 33.31,65.11 | 33.31,65.11 34.07,65.91 34.87,66.67 35.7,67.39 36.57,68.07 37.48,68.71 38.41,69.3 39.37,69.84 40.36,70.34 41.37,70.79 42.4,71.19 43.45,71.53 44.51,71.83 45.59,72.07 46.68,72.26 47.77,72.39 48.71,72.46
  Top 0.203: 51.14,64.95 50.71,64.98 49.98,65 49.24,64.98 48.51,64.93 47.78,64.84 47.05,64.71 46.33,64.55 45.62,64.35 44.92,64.12 44.24,63.86 43.56,63.56 42.91,63.23 42.27,62.87 41.64,62.47 41.04,62.05 40.46,61.59 39.9,61.11 39.37,60.61 38.86,60.07 38.38,59.52 37.93,58.94 36.41,59.33 36.01,58.71 36.75,57.07 36.42,56.41 36.12,55.74 35.85,55.05 35.62,54.35 34.13,54.24 33.77,52.93 35.14,52.2 35.05,51.47 35,50.74 34.98,50 35,49.26 35.05,48.53 35.14,47.8 35.27,47.07 35.43,46.35 35.62,45.65 35.85,44.95 36.12,44.26 36.42,43.59 36.75,42.93 37.11,42.29 37.51,41.67 37.93,41.06 38.38,40.48 38.86,39.93 39.37,39.39 39.9,38.89 40.46,38.41 40.44,36.25 41.04,35.73 42.27,37.13 42.91,36.77 43.56,36.44 44.24,36.14 44.92,35.88 45.62,35.65 45.83,34.05 47.15,33.89 47.78,35.16 48.51,35.07 49.24,35.02 49.98,35 50.71,35.02 51.45,35.07 52.18,35.16 52.9,35.29 53.62,35.45 54.33,35.65 55.03,35.88 55.72,36.14 56.39,36.44 57.05,36.77 58.19,35.83 59.31,36.53 58.91,37.95 59.49,38.41 60.05,38.89 60.58,39.39 61.09,39.93 61.37,40.25 | 51.14,64.95 51.45,64.93 52.18,64.84 52.9,64.71 53.62,64.55 54.33,64.35 55.03,64.12 55.72,63.86 56.39,63.56 57.05,63.23 57.69,62.87 58.31,62.47 58.91,62.05 59.49,61.59 59.73,61.39 | 59.73,61.39 60.05,61.11 60.58,60.61 61.09,60.07 61.57,59.52 62.03,58.94 62.45,58.33 62.84,57.71 63.21,57.07 63.54,56.41 63.77,55.88 | 63.77,55.88 63.84,55.74 64.1,55.05 64.33,54.35 66.13,53.95 66.29,53.23 64.82,52.2 64.91,51.47 64.96,50.74 64.98,50 64.96,49.26 64.92,48.74 | 64.92,48.74 64.91,48.53 64.82,47.8 64.69,47.07 64.53,46.35 64.33,45.65 64.1,44.95 63.84,44.26 63.54,43.59 63.21,42.93 62.84,42.29 62.45,41.67 62.03,41.06 61.57,40.48 61.37,40.25
  Top 0.203: H3E.MP 63.77,55.88 | H3D.MP 70.76,58.61 | H3C.MP 77.64,61.61 | H3B.MP 84.62,64.35 | H3A.MP 91.55,67.22 | LED31.C 27.5,51.1 | LED32.A 33.31,65.11 | LED33.C 51.14,64.95 | LED35.C 64.92,48.74 | LED27.C 72.44,48.73 | LED11.A 87.45,51.29 | LED12.C 75.73,22.76 | LED28.A 66.74,34.99 | LED36.A 61.37,40.25 | LED29.C 48.87,27.53 | LED30.A 35.02,33.2 | LED25.A 48.71,72.46 | LED26.C 66.65,65.11 | LED34.A 59.73,61.39 | v77.98,12 v80.33,10.55
  Bottom 0.203: v77.23,13.25 v77.98,12 | v80.33,10.55 86.18,4.7 IC2.9
CP4  (via drill 0.3)  (4 unrouted)
  Top 0.203: 71.04,10.82 72.86,11.83 74.7,13 76.49,14.26 78.21,15.6 79.86,17.03 81.44,18.53 82.95,20.12 84.38,21.77 85.72,23.49 86.98,25.28 88.15,27.12 89.22,29.02 90.21,30.97 91.09,32.97 91.88,35.01 92.56,37.08 93.14,39.19 93.62,41.32 94,43.47 94.26,45.64 94.42,47.82 94.48,50 94.42,52.18 94.26,54.36 94,56.53 93.62,58.68 93.14,60.81 92.56,62.92 91.88,64.99 91.09,67.03 90.21,69.03 89.22,70.98 88.15,72.88 86.98,74.72 85.72,76.51 84.38,78.23 82.95,79.88 81.44,81.47 79.86,82.97 78.21,84.4 76.49,85.74 74.7,87 72.86,88.17 70.95,89.25 69,90.23 67.01,91.11 64.97,91.9 62.9,92.58 60.79,93.17 58.66,93.64 56.51,94.02 54.34,94.29 52.16,94.45 49.98,94.5 47.79,94.45 45.62,94.29 43.45,94.02 41.3,93.64 39.16,93.17 37.06,92.58 34.99,91.9 32.95,91.11 30.95,90.23 29,89.25 27.1,88.17 25.25,87 23.47,85.74 21.75,84.4 20.09,82.97 18.51,81.47 17.01,79.88 15.58,78.23 14.23,76.51 12.98,74.72 11.81,72.88 10.73,70.98 9.75,69.03 8.86,67.03 8.08,64.99 7.39,62.92 6.81,60.81 6.33,58.68 5.96,56.53 5.69,54.36 5.53,52.18 5.48,50 5.53,47.82 5.69,45.64 5.96,43.47 6.33,41.32 6.81,39.19 7.39,37.08 8.08,35.01 8.86,32.97 9.75,30.97 10.73,29.02 11.81,27.12 12.98,25.28 14.23,23.49 15.58,21.77 17.01,20.12 18.51,18.53 20.09,17.03 21.75,15.6 23.47,14.26 25.25,13 27.1,11.83 29,10.76 30.95,9.77 32.95,8.89 34.99,8.1 37.06,7.42 39.16,6.83 41.3,6.36 43.45,5.98 45.62,5.71 47.79,5.55 49.98,5.5 52.16,5.55 54.34,5.71 56.51,5.98 58.66,6.36 60.79,6.83 62.9,7.42 64.97,8.1 67.01,8.89 69,9.77 70.95,10.76 71.04,10.82 | 79.14,72.76 78.58,73.47 77.39,74.85 76.14,76.16 74.83,77.42 73.45,78.6 72.02,79.72 70.53,80.76 69,81.74 67.42,82.63 65.8,83.45 64.14,84.18 62.44,84.84 60.72,85.41 58.97,85.89 57.2,86.29 55.41,86.6 53.6,86.82 51.79,86.95 49.98,87 48.16,86.95 46.35,86.82 45.54,86.72
  Top 0.203: 79.14,72.76 79.7,72.04 80.74,70.56 81.71,69.02 82.61,67.44 83.43,65.82 84.16,64.16 84.81,62.47 85.38,60.74 85.87,58.99 86.27,57.22 86.58,55.43 86.8,53.63 86.93,51.82 86.98,50 86.93,48.18 86.8,46.37 86.58,44.57 86.27,42.78 85.87,41.01 85.38,39.26 84.81,37.53 84.16,35.84 83.43,34.18 82.61,32.56 81.71,30.98 80.74,29.44 79.7,27.96 78.58,26.53 77.39,25.15 76.14,23.84 74.83,22.59 73.45,21.4 72.02,20.28 70.53,19.24 69,18.26 68.47,17.96 | 68.47,17.96 67.42,17.37 65.8,16.55 64.14,15.82 62.44,15.16 60.72,14.59 58.97,14.11 57.2,13.71 55.41,13.4 53.6,13.18 51.79,13.04 49.98,13 48.16,13.04 46.35,13.18 44.55,13.4 42.76,13.71 40.99,14.11 39.24,14.59 37.51,15.16 35.82,15.82 34.16,16.55 32.54,17.37 30.96,18.26 29.42,19.24 27.94,20.28 26.5,21.4 25.13,22.59 23.81,23.84 22.56,25.15 21.38,26.53 20.26,27.96 19.21,29.44 18.24,30.98 17.35,32.56 16.53,34.18 15.79,35.84 15.14,37.53 14.57,39.26 14.09,41.01 13.69,42.78 13.38,44.57 13.16,46.37 13.02,48.18 12.98,50 13.02,51.82 13.16,53.63 13.38,55.43 13.69,57.22 14.09,58.99 14.57,60.74 15.14,62.47 15.79,64.16 16.53,65.82 17.35,67.44 18.24,69.02 19.21,70.56 20.26,72.04 21.38,73.47 22.56,74.85 23.81,76.16 25.13,77.42 26.5,78.6 27.94,79.72 29.42,80.76 30.96,81.74 32.54,82.63 34.16,83.45 35.82,84.18 37.51,84.84 39.24,85.41 40.99,85.89 42.76,86.29 44.55,86.6 45.54,86.72 | 64.72,24.46 65.14,24.7 66.37,25.47 67.55,26.3 68.69,27.2 69.79,28.14 70.84,29.14 71.84,30.19 72.78,31.29 73.67,32.43 74.51,33.61 75.28,34.83 75.99,36.09 76.65,37.39 77.23,38.71 77.75,40.06 78.21,41.44 78.59,42.83 78.91,44.24 79.16,45.67 79.34,47.11 79.44,48.55 79.48,50 79.44,51.45 79.34,52.89 79.16,54.33 78.91,55.76 78.59,57.17 78.21,58.56 77.75,59.94 77.23,61.29 76.65,62.61 75.99,63.91 75.28,65.17 74.51,66.39 73.67,67.57 72.78,68.72 71.84,69.81 70.84,70.86 69.79,71.86 68.69,72.8 67.55,73.69 66.37,74.53 65.14,75.3 63.88,76.02 62.59,76.67 61.27,77.25 59.92,77.78 58.54,78.23 57.15,78.62 55.73,78.93 54.31,79.18 52.87,79.36 51.42,79.46 49.98,79.5 48.53,79.46 47.09,79.36 45.65,79.18 44.22,78.93 42.81,78.62 41.41,78.23 40.04,77.78 38.69,77.25 37.36,76.67 36.07,76.02 34.81,75.3 33.59,74.53 32.4,73.69 31.89,73.3
  Top 0.203: 64.72,24.46 63.88,23.98 62.59,23.33 61.27,22.75 59.92,22.22 58.54,21.77 57.15,21.38 55.73,21.07 54.31,20.82 52.87,20.64 51.42,20.54 49.98,20.5 48.53,20.54 47.09,20.64 45.65,20.82 44.22,21.07 42.81,21.38 41.41,21.77 40.04,22.22 38.69,22.75 37.36,23.33 36.07,23.98 34.81,24.7 33.59,25.47 32.4,26.3 31.26,27.2 30.17,28.14 29.12,29.14 28.12,30.19 27.17,31.29 26.28,32.43 25.45,33.61 24.67,34.83 23.96,36.09 23.31,37.39 22.72,38.71 22.2,40.06 21.75,41.44 21.36,42.83 21.04,44.24 20.8,45.67 20.74,46.17 | 20.74,46.17 20.62,47.11 20.51,48.55 20.48,50 20.51,51.45 20.62,52.89 20.8,54.33 21.04,55.76 21.36,57.17 21.75,58.56 22.2,59.94 22.72,61.29 23.31,62.61 23.96,63.91 24.67,65.17 25.45,66.39 26.28,67.57 27.17,68.72 28.12,69.81 29.12,70.86 30.17,71.86 31.26,72.8 31.39,72.9 31.89,73.3 | 61.13,31.04 61.29,31.13 62.2,31.71 63.08,32.33 63.93,32.99 64.75,33.7 65.53,34.44 66.28,35.23 66.98,36.04 67.65,36.9 68.27,37.78 68.85,38.69 69.38,39.63 69.87,40.59 70.3,41.58 70.69,42.59 71.03,43.61 71.32,44.65 71.55,45.71 71.74,46.77 71.87,47.84 71.95,48.92 71.98,50 71.95,51.08 71.87,52.16 71.74,53.23 71.55,54.29 71.32,55.35 71.03,56.39 70.69,57.41 70.3,58.42 69.87,59.41 69.38,60.37 68.85,61.31 68.27,62.22 67.65,63.1 66.98,63.96 66.28,64.77 65.53,65.56 64.75,66.3 63.93,67.01 63.08,67.67 62.2,68.29 61.29,68.87 60.35,69.4 59.38,69.89 58.4,70.33 57.39,70.71 56.36,71.05 55.32,71.34 54.27,71.58 53.21,71.76 52.13,71.89 51.06,71.97 49.98,72 48.9,71.97 47.82,71.89 46.75,71.76 45.69,71.58 44.63,71.34 43.59,71.05 42.57,70.71 41.56,70.33 40.57,69.89 39.61,69.4 38.67,68.87 37.75,68.29 36.87,67.67 36.02,67.01 35.2,66.3 34.42,65.56 33.68,64.77 32.97,63.96 32.31,63.1 31.69,62.22 31.11,61.31 30.58,60.37 30.09,59.41 29.65,58.42 29.26,57.41 28.92,56.39 28.64,55.35 28.4,54.29 28.22,53.23 28.08,52.16 28,51.08 27.98,50 28,48.92 28.08,47.84 28.22,46.77 28.4,45.71 28.64,44.65 28.92,43.61 29.26,42.59 29.65,41.58 30.09,40.59 30.58,39.63 31.11,38.69 31.69,37.78 32.31,36.9 32.97,36.04 33.68,35.23 34.42,34.44 35.2,33.7 36.02,32.99 36.87,32.33 37.75,31.71 38.67,31.13 39.61,30.6 40.57,30.11 41.56,29.68 42.57,29.29 43.59,28.95 44.63,28.66 45.69,28.42 46.75,28.24 47.82,28.11 48.9,28.03 49.98,28 51.06,28.03 52.13,28.11 53.21,28.24 54.27,28.42 55.32,28.66 56.36,28.95 57.39,29.29 58.4,29.68 59.38,30.11 60.35,30.6 61.13,31.04
  Top 0.203: 64.14,53.08 64.04,53.52 63.85,54.21 63.63,54.88 63.37,55.55 63.09,56.2 62.77,56.84 62.41,57.45 62.03,58.06 61.62,58.64 61.19,59.2 60.72,59.74 60.23,60.25 59.72,60.74 59.18,61.21 58.62,61.65 58.03,62.06 57.43,62.44 56.81,62.79 56.18,63.11 55.53,63.4 54.86,63.65 54.19,63.88 53.5,64.06 52.81,64.22 52.11,64.34 51.4,64.43 50.69,64.48 49.98,64.5 49.27,64.48 48.56,64.43 47.85,64.34 47.15,64.22 46.45,64.06 45.77,63.88 45.09,63.65 44.43,63.4 43.78,63.11 43.14,62.79 42.52,62.44 41.92,62.06 41.34,61.65 40.78,61.21 40.24,60.74 39.72,60.25 39.23,59.74 38.77,59.2 38.33,58.64 37.92,58.06 37.83,57.91 | 64.14,53.08 64.2,52.83 64.32,52.13 64.41,51.42 64.46,50.71 64.48,50 64.46,49.29 64.41,48.58 64.32,47.87 64.2,47.17 64.04,46.48 63.85,45.79 63.63,45.12 63.37,44.45 63.09,43.8 62.77,43.16 62.41,42.55 62.03,41.94 61.62,41.36 61.19,40.8 60.72,40.26 60.23,39.75 59.72,39.26 59.18,38.79 58.62,38.35 58.03,37.94 57.77,37.78 | 57.77,37.78 57.43,37.56 56.81,37.21 56.18,36.89 55.53,36.6 54.86,36.35 54.19,36.12 53.5,35.94 52.81,35.78 52.11,35.66 51.4,35.57 50.69,35.52 49.98,35.5 49.27,35.52 48.56,35.57 47.85,35.66 47.15,35.78 46.85,35.85 | 46.85,35.85 46.45,35.94 45.77,36.12 45.09,36.35 44.43,36.6 43.78,36.89 43.14,37.21 42.52,37.56 41.92,37.94 41.79,38.04 | 41.79,38.04 41.34,38.35 40.78,38.79 40.24,39.26 39.72,39.75 39.23,40.26 38.77,40.8 38.33,41.36 37.92,41.94 37.54,42.55 37.19,43.16 36.87,43.8 36.58,44.45 36.33,45.12 36.1,45.79 35.91,46.48 35.76,47.17 35.63,47.87 35.55,48.58 35.49,49.29 35.48,50 35.49,50.71 35.55,51.42 35.63,52.13 35.76,52.83 35.86,53.27
  Top 0.203: 35.86,53.27 35.91,53.52 36.1,54.21 36.33,54.88 36.58,55.55 36.87,56.2 37.19,56.84 37.54,57.45 37.83,57.91 | v19.48,46 20.74,46.17 | v30.98,74.5 31.89,73.3 | v45.48,87.9 45.54,86.72 | v36.78,58.5 37.83,57.91 | v41.08,37 41.79,38.04 | v34.68,53.5 35.86,53.27 | v58.48,36.8 57.77,37.78 | v46.58,34.7 46.85,35.85 | v71.68,9.5 71.04,10.82 | v69.08,16.8 68.47,17.96 | v65.38,23.2 64.72,24.46 | v61.68,29.8 61.13,31.04 | v80.18,73.5 79.14,72.76 | v65.28,53.4 64.14,53.08 | v75.98,10.5 v78.53,9
  Bottom 0.203: LED23.A v19.48,46 | LED24.C v30.98,74.5 | LED9.A v45.48,87.9 | LED40.A v36.78,58.5 | LED38.A v41.08,37 | LED39.C v34.68,53.5 | H4E.MP v58.48,36.8 LED36.C | v46.58,34.7 LED37.C | H4A.MP v71.68,9.5 v75.98,10.5 | H4B.MP v69.08,16.8 | H4C.MP v65.38,23.2 | H4D.MP v61.68,29.8 | LED10.C v80.18,73.5 | LED35.A v65.28,53.4 | v78.53,9 82.83,4.7 84.68,4.7 IC2.8
CP5  (via drill 0.3)  (6 unrouted)
  Top 0.203: 51.59,60.88 51.06,60.95 50.52,60.99 49.98,61 49.44,60.99 48.9,60.95 48.36,60.88 47.83,60.79 47.3,60.67 46.78,60.53 46.27,60.36 45.77,60.16 45.27,59.94 44.79,59.7 44.32,59.44 43.87,59.15 43.42,58.84 43,58.5 42.59,58.15 42.2,57.78 41.83,57.39 41.47,56.98 41.14,56.55 40.83,56.11 40.54,55.66 40.28,55.19 40.03,54.7 39.81,54.21 39.62,53.71 39.45,53.19 39.31,52.67 39.19,52.15 39.1,51.61 39.03,51.08 38.99,50.54 38.98,50 38.99,49.46 39.03,48.92 39.1,48.39 | 51.59,60.88 52.12,60.79 52.65,60.67 53.17,60.53 53.68,60.36 54.19,60.16 | 54.19,60.16 54.68,59.94 55.16,59.7 55.63,59.44 56.09,59.15 56.53,58.84 56.96,58.5 57.36,58.15 57.76,57.78 58.13,57.39 58.48,56.98 58.81,56.55 59.12,56.11 59.41,55.66 59.68,55.19 59.92,54.7 60.14,54.21 60.33,53.71 60.5,53.19 60.65,52.67 60.77,52.15 60.86,51.61 60.88,51.46 | 60.88,51.46 60.92,51.08 60.96,50.54 60.98,50 60.96,49.46 60.92,48.92 60.86,48.39 60.77,47.85 60.65,47.33 60.5,46.81 60.33,46.29 60.14,45.79 59.92,45.3 59.68,44.81 59.41,44.34 59.12,43.89 58.81,43.45 58.48,43.02 58.13,42.61 57.76,42.22 57.36,41.85 56.96,41.5 56.53,41.16 56.09,40.85 55.63,40.56 55.16,40.3 54.68,40.06 54.19,39.84 53.68,39.64 53.17,39.47 52.65,39.33 52.12,39.21 51.59,39.12 51.06,39.05 50.52,39.01 49.98,39 49.44,39.01 48.9,39.05 48.36,39.12 | 48.36,39.12 47.83,39.21 47.3,39.33 46.78,39.47 46.27,39.64 45.77,39.84 45.27,40.06 44.79,40.3 44.32,40.56 43.87,40.85 43.42,41.16 43,41.5 42.59,41.85 42.2,42.22 41.83,42.61 41.47,43.02 41.14,43.45 40.83,43.89 40.54,44.34 40.28,44.81 40.03,45.3 39.81,45.79 39.62,46.29 39.45,46.81 39.31,47.33 39.19,47.85 39.1,48.39
  Top 0.203: LED43.C 48.36,39.12 | LED42.A 60.88,51.46 | LED41.C 51.59,60.88 | H5F.MP 54.19,60.16 | LED44.A 39.1,48.39 | LED7.A v3.08,44.7 | LED8.C v20.88,87.2 | H5A.MP v62.58,95.3 | H5B.MP v60.48,88.3 | H5C.MP v58.88,80.8 | H5D.MP v56.68,73.6 | H5E.MP v53.98,66.7 | v46.18,66.8 LED33.A | LED21.A v55.18,18.2 | LED22.C v24.48,30.3 | LED34.C v64.48,59.3 | LED45.C H5G.MP
  Bottom 0.203: 63.02,96.7 61.76,97.05 59.44,97.57 57.09,97.97 54.73,98.27 52.36,98.44 49.98,98.5 47.6,98.44 45.22,98.27 42.86,97.97 40.52,97.57 38.19,97.05 35.9,96.41 33.64,95.67 31.42,94.81 29.24,93.84 27.11,92.77 25.04,91.6 23.03,90.33 21.09,88.96 20.2,88.26 | 63.02,96.7 64.06,96.41 66.32,95.67 68.54,94.81 70.71,93.84 72.84,92.77 74.91,91.6 76.92,90.33 78.87,88.96 80.75,87.49 82.55,85.94 84.27,84.3 85.91,82.57 87.47,80.77 88.93,78.89 90.3,76.94 91.58,74.93 92.75,72.86 93.82,70.74 94.79,68.56 95.64,66.34 96.39,64.08 97.02,61.78 97.55,59.46 97.95,57.12 98.24,54.75 98.42,52.38 98.48,50 98.42,47.62 98.24,45.25 97.95,42.88 97.55,40.54 97.02,38.22 96.39,35.92 95.64,33.66 94.79,31.44 93.82,29.26 92.75,27.14 91.58,25.07 90.3,23.05 88.93,21.11 87.47,19.23 85.91,17.43 | 85.91,17.43 84.27,15.71 82.55,14.06 81.25,12.76 81.23,12.25 79.73,11 78.62,10.79 76.92,9.67 74.91,8.4 72.84,7.23 70.71,6.16 68.54,5.19 66.32,4.33 64.06,3.59 61.76,2.95 59.44,2.43 57.09,2.02 54.73,1.73 52.36,1.56 49.98,1.5 47.6,1.56 45.22,1.73 42.86,2.02 40.52,2.43 38.19,2.95 35.9,3.59 33.64,4.33 31.42,5.19 29.24,6.16 27.11,7.23 25.04,8.4 23.03,9.67 21.09,11.04 19.21,12.51 17.41,14.06 15.68,15.71 14.04,17.43 12.49,19.23 11.02,21.11 9.65,23.05 8.38,25.07 7.2,27.14 6.13,29.26 5.17,31.44 4.31,33.66 3.57,35.92 2.93,38.22 2.41,40.54 2,42.88 1.8,44.54 | 1.8,44.54 1.71,45.25 1.54,47.62 1.48,50 1.54,52.38 1.71,54.75 2,57.12 2.41,59.46 2.93,61.78 3.57,64.08 4.31,66.34 5.17,68.56 6.13,70.74 7.2,72.86 8.38,74.93 9.65,76.94 11.02,78.89 12.49,80.77 14.04,82.57 15.68,84.3 17.41,85.94 19.21,87.49 20.2,88.26
  Bottom 0.203: 60.92,89.5 59.94,89.77 57.98,90.21 55.99,90.56 54,90.8 51.99,90.95 49.98,91 47.97,90.95 45.96,90.8 43.96,90.56 41.98,90.21 40.02,89.77 38.08,89.23 36.17,88.6 34.29,87.88 32.45,87.06 30.65,86.16 28.9,85.17 27.2,84.09 25.55,82.93 23.97,81.69 22.44,80.38 20.99,78.99 19.6,77.53 18.28,76.01 17.05,74.42 15.89,72.78 14.81,71.08 13.82,69.33 12.91,67.53 12.1,65.69 11.37,63.81 10.74,61.9 10.21,59.96 9.77,58 9.42,56.02 9.17,54.02 9.03,52.01 8.98,50 9.03,47.99 9.17,45.98 9.42,43.98 9.77,42 10.21,40.04 10.74,38.1 11.37,36.19 12.1,34.31 12.91,32.47 13.82,30.67 14.81,28.92 15.89,27.22 17.05,25.58 18.28,23.99 19.6,22.47 20.99,21.01 22.44,19.62 23.97,18.31 25.55,17.07 27.2,15.91 28.9,14.83 30.65,13.84 32.45,12.94 34.29,12.12 36.17,11.4 38.08,10.77 40.02,10.23 41.98,9.79 43.96,9.44 45.96,9.2 47.97,9.05 49.98,9 51.99,9.05 54,9.2 55.99,9.44 57.98,9.79 59.94,10.23 61.88,10.77 63.79,11.4 65.67,12.12 67.51,12.94 69.3,13.84 71.06,14.83 72.76,15.91 74.4,17.07 75.99,18.31 77.51,19.62 78.97,21.01 80.36,22.47 81.67,23.99 82.91,25.58 84.07,27.22 85.14,28.92 86.14,30.67 87.04,32.47 87.86,34.31 88.58,36.19 89.21,38.1 89.75,40.04 90.19,42 90.53,43.98 90.78,45.98 90.93,47.99 90.98,50 90.93,52.01 90.78,54.02 90.53,56.02 90.19,58 89.75,59.96 89.21,61.9 88.58,63.81 87.86,65.69 87.04,67.53 86.14,69.33 85.14,71.08 84.07,72.78 82.91,74.42 81.67,76.01 80.36,77.53 78.97,78.99 77.51,80.38 75.99,81.69 74.4,82.93 72.76,84.09 71.06,85.17 69.3,86.16 67.51,87.06 65.67,87.88 63.79,88.6 61.88,89.23 60.92,89.5 | 59.31,82.17 58.12,82.5 56.51,82.86 54.89,83.14 53.26,83.34 51.62,83.46 49.98,83.5 48.33,83.46 46.69,83.34 45.06,83.14 43.44,82.86 41.84,82.5 40.25,82.06 38.69,81.54 37.16,80.95 35.65,80.28 34.19,79.54 32.76,78.73 31.37,77.85 30.02,76.91 28.73,75.9 27.48,74.82 26.29,73.69 25.16,72.5 24.08,71.25 23.07,69.96 22.12,68.61 21.24,67.22 20.43,65.79 19.69,64.32 19.03,62.82 18.44,61.29 17.92,59.73 17.48,58.14 17.12,56.54 16.84,54.91 16.64,53.28 16.52,51.64 16.48,50 16.52,48.36 16.64,46.72 16.84,45.09 17.12,43.46 17.48,41.86 17.92,40.27 18.44,38.71 19.03,37.18 19.69,35.68 20.43,34.21 21.24,32.78 22.12,31.39 23.07,30.04 23.48,29.52
  Bottom 0.203: 59.31,82.17 59.7,82.06 61.26,81.54 62.8,80.95 64.3,80.28 65.77,79.54 67.2,78.73 68.59,77.85 69.93,76.91 71.23,75.9 72.47,74.82 73.67,73.69 74.8,72.5 75.87,71.25 76.88,69.96 77.83,68.61 78.71,67.22 79.52,65.79 80.26,64.32 80.93,62.82 81.52,61.29 82.04,59.73 82.47,58.14 82.83,56.54 83.11,54.91 83.32,53.28 83.44,51.64 83.48,50 83.44,48.36 83.32,46.72 83.11,45.09 82.83,43.46 82.47,41.86 82.04,40.27 81.52,38.71 80.93,37.18 80.26,35.68 79.52,34.21 78.71,32.78 77.83,31.39 76.88,30.04 75.87,28.75 74.8,27.5 73.67,26.31 72.47,25.18 71.23,24.1 69.93,23.09 68.59,22.15 67.2,21.27 65.77,20.46 64.3,19.72 62.8,19.05 61.26,18.46 59.7,17.94 58.12,17.5 56.51,17.14 55.31,16.93 | 55.31,16.93 54.89,16.86 53.26,16.66 51.62,16.54 49.98,16.5 48.33,16.54 46.69,16.66 45.06,16.86 43.44,17.14 41.84,17.5 40.25,17.94 38.69,18.46 37.16,19.05 35.65,19.72 34.19,20.46 32.76,21.27 31.37,22.15 30.02,23.09 28.73,24.1 27.48,25.18 26.29,26.31 25.16,27.5 24.08,28.75 23.48,29.52 | 57.02,75.02 56.29,75.22 55.05,75.5 53.79,75.72 52.53,75.88 51.25,75.97 49.98,76 48.7,75.97 47.43,75.88 46.16,75.72 44.91,75.5 43.66,75.22 42.43,74.88 41.22,74.48 40.03,74.02 38.86,73.5 37.72,72.93 36.61,72.3 35.53,71.62 34.49,70.88 33.48,70.1 32.52,69.27 31.59,68.39 30.71,67.46 29.88,66.49 29.09,65.49 28.36,64.44 27.68,63.37 27.05,62.26 26.47,61.12 25.96,59.95 25.5,58.76 25.1,57.55 24.76,56.32 24.48,55.07 24.26,53.81 24.1,52.55 24.01,51.28 23.98,50 24.01,48.72 24.1,47.45 24.26,46.19 24.48,44.93 24.76,43.68 25.1,42.45 25.5,41.24 25.96,40.05 26.47,38.88 27.05,37.74 27.68,36.63 28.36,35.55 29.09,34.51 29.88,33.51 30.71,32.54 31.59,31.61 32.52,30.73 33.48,29.9 34.49,29.12 35.53,28.38 36.61,27.7 37.72,27.07 38.86,26.5 40.03,25.98 41.22,25.52 42.43,25.12 43.66,24.78 44.91,24.5 46.16,24.28 47.43,24.12 48.7,24.03 49.98,24 51.25,24.03 52.53,24.12 53.79,24.28 55.05,24.5 56.29,24.78 57.52,25.12 58.74,25.52 59.93,25.98 61.09,26.5 62.23,27.07 63.34,27.7 64.42,28.38 65.47,29.12 66.47,29.9 67.44,30.73 68.36,31.61 69.24,32.54 70.08,33.51 70.86,34.51 71.6,35.55 72.28,36.63 72.91,37.74 73.48,38.88 74,40.05 74.46,41.24 74.86,42.45 75.2,43.68 75.48,44.93 75.7,46.19 75.85,47.45 75.95,48.72 75.98,50 75.95,51.28 75.85,52.55 75.7,53.81 75.48,55.07 75.2,56.32 74.86,57.55 74.46,58.76 74,59.95 73.48,61.12 72.91,62.26 72.28,63.37 71.6,64.44 70.86,65.49 70.08,66.49 69.24,67.46 68.36,68.39 67.44,69.27 66.47,70.1 65.47,70.88 64.42,71.62 63.34,72.3 62.23,72.93 61.09,73.5 59.93,74.02 58.74,74.48 57.52,74.88 57.02,75.02